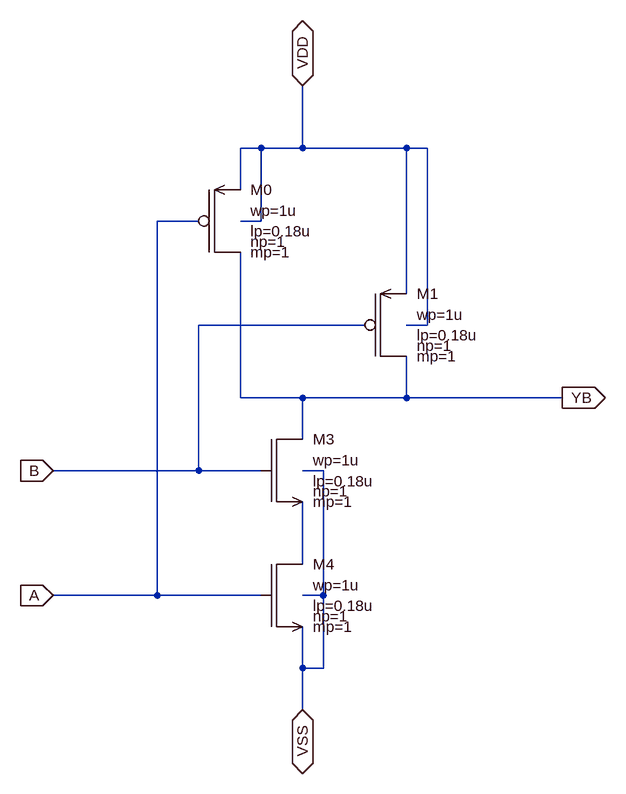
[diagram p0: schematic na21.asc]
na21.asc, the LTspice schematic file:
Version 4
SHEET 1 960 1152
WIRE 416 192 384 192
WIRE 480 192 480 96
WIRE 480 192 416 192
WIRE 640 192 480 192
WIRE 672 192 640 192
WIRE 384 256 384 192
WIRE 320 304 256 304
WIRE 416 304 416 192
WIRE 416 304 384 304
WIRE 640 416 640 192
WIRE 576 464 320 464
WIRE 672 464 672 192
WIRE 672 464 640 464
WIRE 384 576 384 352
WIRE 480 576 384 576
WIRE 640 576 640 512
WIRE 640 576 480 576
WIRE 880 576 640 576
WIRE 480 640 480 576
WIRE 320 688 320 464
WIRE 320 688 96 688
WIRE 416 688 320 688
WIRE 512 688 480 688
WIRE 480 832 480 736
WIRE 256 880 256 304
WIRE 256 880 96 880
WIRE 416 880 256 880
WIRE 512 880 512 688
WIRE 512 880 480 880
WIRE 480 992 480 928
WIRE 512 992 512 880
WIRE 512 992 480 992
WIRE 480 1056 480 992
FLAG 480 1056 VSS
IOPIN 480 1056 BiDir
FLAG 480 96 VDD
IOPIN 480 96 BiDir
FLAG 96 688 B
IOPIN 96 688 In
FLAG 96 880 A
IOPIN 96 880 In
FLAG 880 576 YB
IOPIN 880 576 Out
SYMBOL ptm180_nmos1p8 416 880 R0
SYMATTR InstName M4
SYMATTR Value wp=1u
SYMATTR Value2 lp=0.18u
SYMBOL ptm180_nmos1p8 416 688 R0
SYMATTR InstName M3
SYMATTR Value wp=1u
SYMATTR Value2 lp=0.18u
SYMBOL ptm180_pmos1p8 576 464 R0
SYMATTR InstName M1
SYMATTR Value wp=1u
SYMATTR Value2 lp=0.18u
SYMBOL ptm180_pmos1p8 320 304 R0
SYMATTR InstName M0
SYMATTR Value wp=1u
SYMATTR Value2 lp=0.18u

The netlist it stands for:
* na21.asc
XM4 N001 A VSS VSS ptm180_nmos1p8 wp=1u lp=0.18u np=1 mp=1  ; pins ND NG NS NB
XM3 YB B N001 VSS ptm180_nmos1p8 wp=1u lp=0.18u np=1 mp=1  ; pins ND NG NS NB
XM1 YB B VDD VDD ptm180_pmos1p8 wp=1u lp=0.18u np=1 mp=1  ; pins ND NG NS NB
XM0 YB A VDD VDD ptm180_pmos1p8 wp=1u lp=0.18u np=1 mp=1  ; pins ND NG NS NB
.lib FREE180nm.model
.backanno
.end